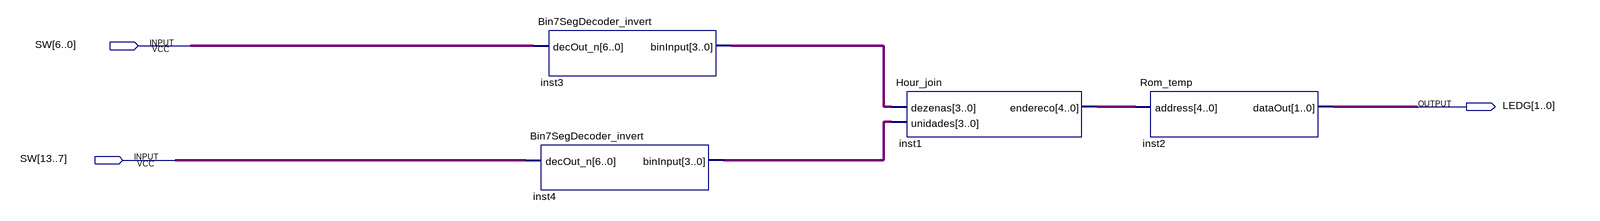
[diagram p0: schematic sheet]
// Quartus schematic projetolsd.bdf as structural Verilog: 4 symbols, 3 pins
module projetolsd (
  input  [13:0] SW,
  output [1:0] LEDG
);

  wire [3:0] inst3_bininput, inst4_bininput;
  wire [4:0] inst1_endereco;

  Bin7SegDecoder_invert inst4 (.decOut_n(SW[13:7]), .binInput(inst4_bininput));
  Bin7SegDecoder_invert inst3 (.decOut_n(SW[6:0]), .binInput(inst3_bininput));
  Hour_join inst1 (.dezenas(inst3_bininput), .unidades(inst4_bininput), .endereco(inst1_endereco));
  Rom_temp inst2 (.address(inst1_endereco), .dataOut(LEDG));
endmodule
